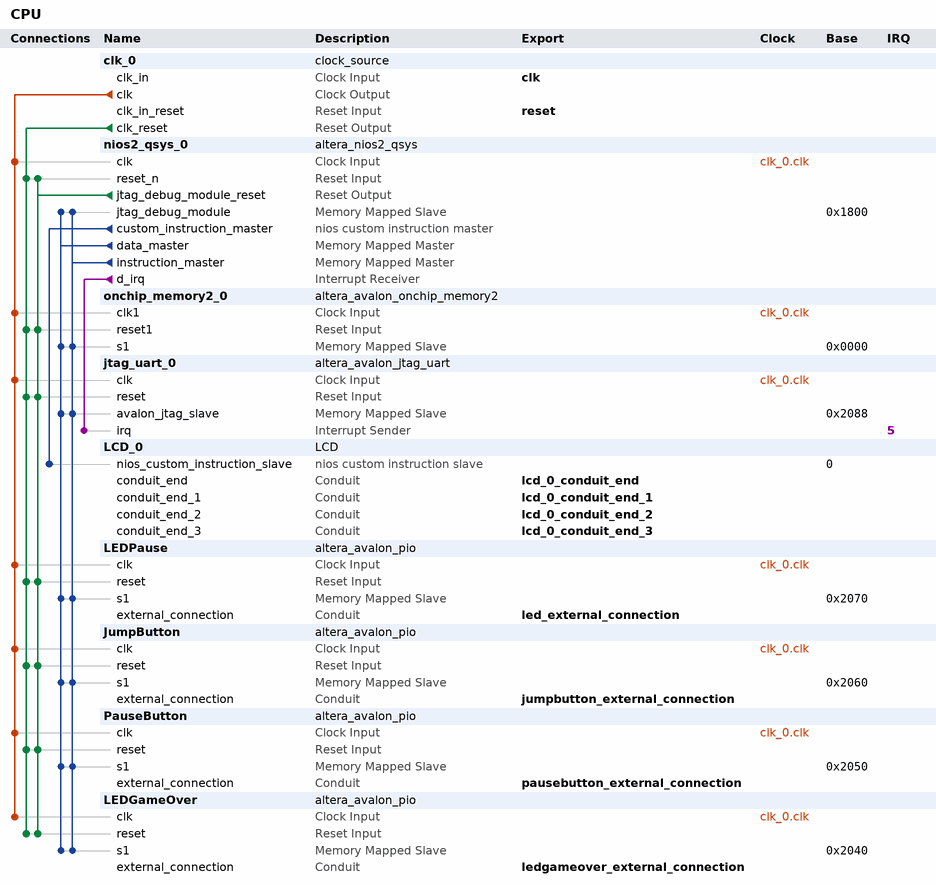
[diagram p0: system contents]
# Platform Designer (Qsys) system CPU, Cyclone IV E EP4CE6E22C8
# Parameters at their usual value, and those the tool derives, are not listed.
package require -exact qsys 13.1
create_system CPU
set_project_property DEVICE_FAMILY {Cyclone IV E}
set_project_property DEVICE EP4CE6E22C8

add_instance clk_0 clock_source 13.1
set_instance_parameter_value clk_0 clockFrequency 50000000

add_instance nios2_qsys_0 altera_nios2_qsys 13.1
set_instance_parameter_value nios2_qsys_0 resetSlave onchip_memory2_0.s1
set_instance_parameter_value nios2_qsys_0 mmu_TLBMissExcSlave None
set_instance_parameter_value nios2_qsys_0 exceptionSlave onchip_memory2_0.s1
set_instance_parameter_value nios2_qsys_0 breakSlave nios2_qsys_0.jtag_debug_module
set_instance_parameter_value nios2_qsys_0 impl Tiny
set_instance_parameter_value nios2_qsys_0 icache_size 4096

add_instance onchip_memory2_0 altera_avalon_onchip_memory2 13.1
set_instance_parameter_value onchip_memory2_0 dataWidth 32
set_instance_parameter_value onchip_memory2_0 dualPort false
set_instance_parameter_value onchip_memory2_0 initMemContent true
set_instance_parameter_value onchip_memory2_0 initializationFileName onchip_mem.hex
set_instance_parameter_value onchip_memory2_0 memorySize 4096
set_instance_parameter_value onchip_memory2_0 useNonDefaultInitFile true

add_instance jtag_uart_0 altera_avalon_jtag_uart 13.1
set_instance_parameter_value jtag_uart_0 simInteractiveOptions NO_INTERACTIVE_WINDOWS

add_instance LCD_0 LCD 1.0

add_instance LEDPause altera_avalon_pio 13.1
set_instance_parameter_value LEDPause direction Output
set_instance_parameter_value LEDPause width 1

add_instance JumpButton altera_avalon_pio 13.1
set_instance_parameter_value JumpButton direction Input
set_instance_parameter_value JumpButton width 1

add_instance PauseButton altera_avalon_pio 13.1
set_instance_parameter_value PauseButton direction Input
set_instance_parameter_value PauseButton width 1

add_instance LEDGameOver altera_avalon_pio 13.1
set_instance_parameter_value LEDGameOver direction Output
set_instance_parameter_value LEDGameOver width 1

# connections
add_connection clk_0.clk jtag_uart_0.clk clock
add_connection clk_0.clk JumpButton.clk clock
add_connection clk_0.clk LEDGameOver.clk clock
add_connection clk_0.clk LEDPause.clk clock
add_connection clk_0.clk nios2_qsys_0.clk clock
add_connection clk_0.clk onchip_memory2_0.clk1 clock
add_connection clk_0.clk PauseButton.clk clock
add_connection clk_0.clk_reset jtag_uart_0.reset reset
add_connection clk_0.clk_reset JumpButton.reset reset
add_connection clk_0.clk_reset LEDGameOver.reset reset
add_connection clk_0.clk_reset LEDPause.reset reset
add_connection clk_0.clk_reset nios2_qsys_0.reset_n reset
add_connection clk_0.clk_reset onchip_memory2_0.reset1 reset
add_connection clk_0.clk_reset PauseButton.reset reset
add_connection nios2_qsys_0.jtag_debug_module_reset jtag_uart_0.reset reset
add_connection nios2_qsys_0.jtag_debug_module_reset JumpButton.reset reset
add_connection nios2_qsys_0.jtag_debug_module_reset LEDGameOver.reset reset
add_connection nios2_qsys_0.jtag_debug_module_reset LEDPause.reset reset
add_connection nios2_qsys_0.jtag_debug_module_reset nios2_qsys_0.reset_n reset
add_connection nios2_qsys_0.jtag_debug_module_reset onchip_memory2_0.reset1 reset
add_connection nios2_qsys_0.jtag_debug_module_reset PauseButton.reset reset
add_connection nios2_qsys_0.data_master jtag_uart_0.avalon_jtag_slave avalon
set_connection_parameter_value nios2_qsys_0.data_master/jtag_uart_0.avalon_jtag_slave baseAddress 0x2088
add_connection nios2_qsys_0.data_master JumpButton.s1 avalon
set_connection_parameter_value nios2_qsys_0.data_master/JumpButton.s1 baseAddress 0x2060
add_connection nios2_qsys_0.data_master LEDGameOver.s1 avalon
set_connection_parameter_value nios2_qsys_0.data_master/LEDGameOver.s1 baseAddress 0x2040
add_connection nios2_qsys_0.data_master LEDPause.s1 avalon
set_connection_parameter_value nios2_qsys_0.data_master/LEDPause.s1 baseAddress 0x2070
add_connection nios2_qsys_0.data_master nios2_qsys_0.jtag_debug_module avalon
set_connection_parameter_value nios2_qsys_0.data_master/nios2_qsys_0.jtag_debug_module baseAddress 0x1800
add_connection nios2_qsys_0.data_master onchip_memory2_0.s1 avalon
set_connection_parameter_value nios2_qsys_0.data_master/onchip_memory2_0.s1 baseAddress 0x0000
add_connection nios2_qsys_0.data_master PauseButton.s1 avalon
set_connection_parameter_value nios2_qsys_0.data_master/PauseButton.s1 baseAddress 0x2050
add_connection nios2_qsys_0.instruction_master jtag_uart_0.avalon_jtag_slave avalon
set_connection_parameter_value nios2_qsys_0.instruction_master/jtag_uart_0.avalon_jtag_slave baseAddress 0x2088
add_connection nios2_qsys_0.instruction_master JumpButton.s1 avalon
set_connection_parameter_value nios2_qsys_0.instruction_master/JumpButton.s1 baseAddress 0x2060
add_connection nios2_qsys_0.instruction_master LEDGameOver.s1 avalon
set_connection_parameter_value nios2_qsys_0.instruction_master/LEDGameOver.s1 baseAddress 0x2040
add_connection nios2_qsys_0.instruction_master LEDPause.s1 avalon
set_connection_parameter_value nios2_qsys_0.instruction_master/LEDPause.s1 baseAddress 0x2070
add_connection nios2_qsys_0.instruction_master nios2_qsys_0.jtag_debug_module avalon
set_connection_parameter_value nios2_qsys_0.instruction_master/nios2_qsys_0.jtag_debug_module baseAddress 0x1800
add_connection nios2_qsys_0.instruction_master onchip_memory2_0.s1 avalon
set_connection_parameter_value nios2_qsys_0.instruction_master/onchip_memory2_0.s1 baseAddress 0x0000
add_connection nios2_qsys_0.instruction_master PauseButton.s1 avalon
set_connection_parameter_value nios2_qsys_0.instruction_master/PauseButton.s1 baseAddress 0x2050
add_connection nios2_qsys_0.d_irq jtag_uart_0.irq interrupt
set_connection_parameter_value nios2_qsys_0.d_irq/jtag_uart_0.irq irqNumber 5
add_connection nios2_qsys_0.custom_instruction_master LCD_0.nios_custom_instruction_slave nios_custom_instruction
set_connection_parameter_value nios2_qsys_0.custom_instruction_master/LCD_0.nios_custom_instruction_slave CIName lcd_0
set_connection_parameter_value nios2_qsys_0.custom_instruction_master/LCD_0.nios_custom_instruction_slave baseAddress 0

# exported interfaces
add_interface clk clock sink
set_interface_property clk EXPORT_OF clk_0.clk_in
add_interface reset reset sink
set_interface_property reset EXPORT_OF clk_0.clk_in_reset
add_interface lcd_0_conduit_end conduit end
set_interface_property lcd_0_conduit_end EXPORT_OF LCD_0.conduit_end
add_interface lcd_0_conduit_end_1 conduit end
set_interface_property lcd_0_conduit_end_1 EXPORT_OF LCD_0.conduit_end_1
add_interface lcd_0_conduit_end_2 conduit end
set_interface_property lcd_0_conduit_end_2 EXPORT_OF LCD_0.conduit_end_2
add_interface lcd_0_conduit_end_3 conduit end
set_interface_property lcd_0_conduit_end_3 EXPORT_OF LCD_0.conduit_end_3
add_interface led_external_connection conduit end
set_interface_property led_external_connection EXPORT_OF LEDPause.external_connection
add_interface jumpbutton_external_connection conduit end
set_interface_property jumpbutton_external_connection EXPORT_OF JumpButton.external_connection
add_interface pausebutton_external_connection conduit end
set_interface_property pausebutton_external_connection EXPORT_OF PauseButton.external_connection
add_interface ledgameover_external_connection conduit end
set_interface_property ledgameover_external_connection EXPORT_OF LEDGameOver.external_connection

set_interconnect_requirement {$system} qsys_mm.clockCrossingAdapter HANDSHAKE
set_interconnect_requirement {$system} qsys_mm.maxAdditionalLatency 1
set_interconnect_requirement {$system} qsys_mm.insertDefaultSlave false

save_system CPU.qsys
